# Altium schematic sheet Magnetics.SchDoc
size A3
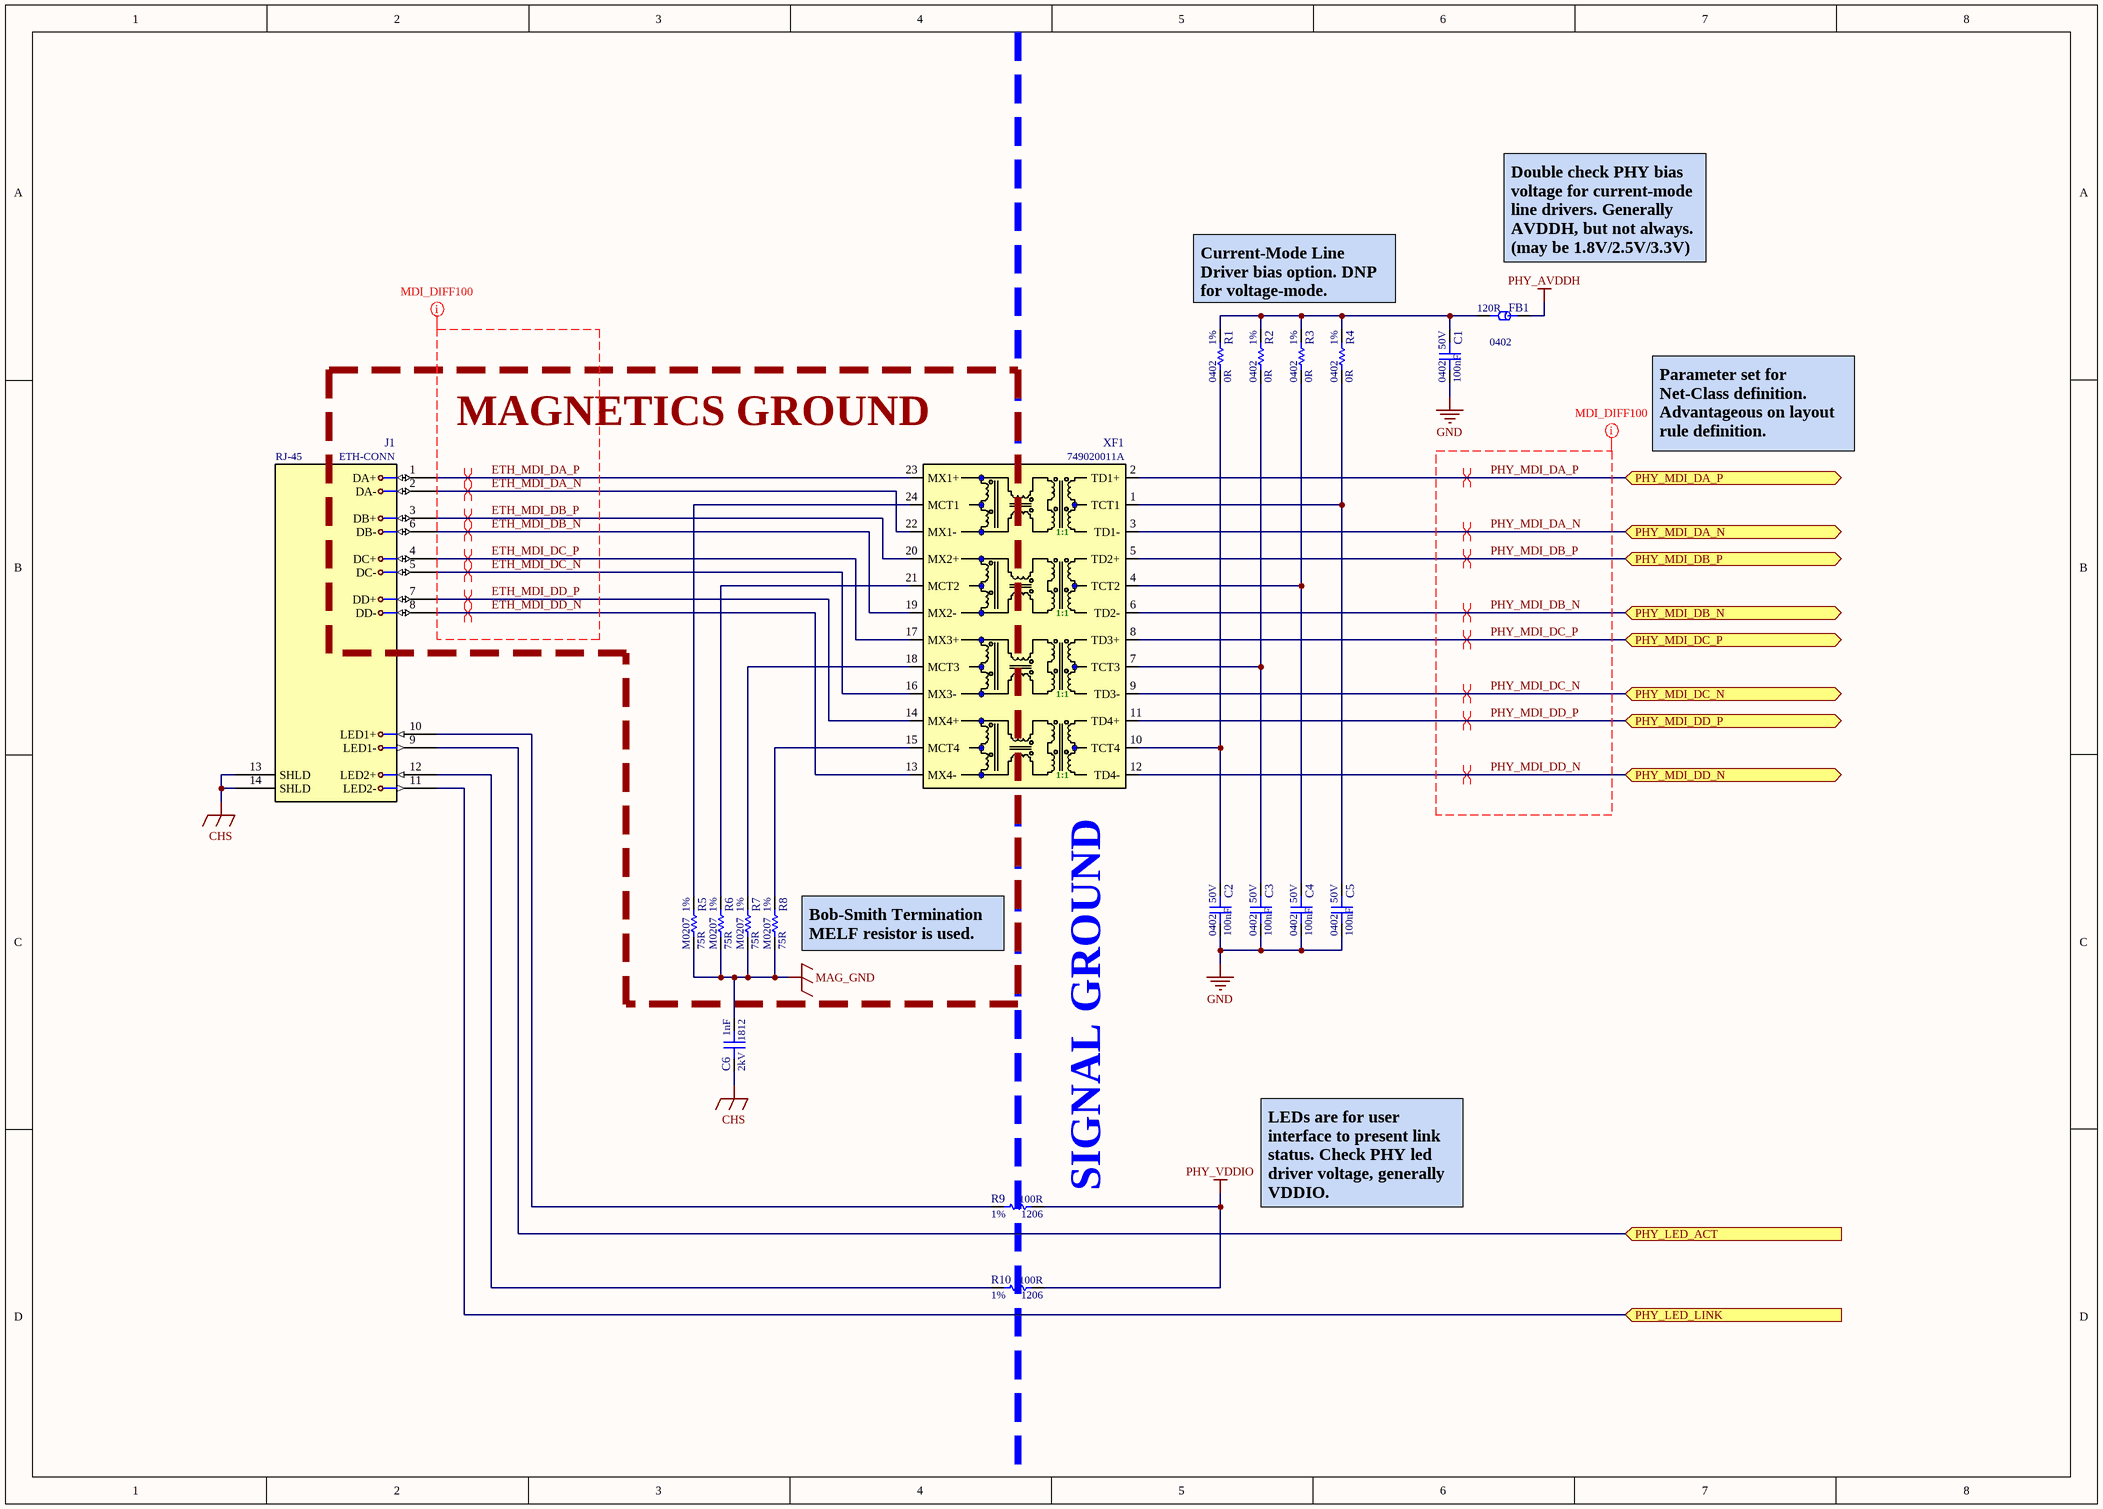
[diagram p0: Magnetics.SchDoc]

## Parts
C1  value 100nF  Voltage: 50V  Package: 0402  [C_0402_GEN_0.70H]  (hidden comment: Capacitor)
C2  value 100nF  Voltage: 50V  Package: 0402  [C_0402_GEN_0.70H]  (hidden comment: Capacitor)
C3  value 100nF  Voltage: 50V  Package: 0402  [C_0402_GEN_0.70H]  (hidden comment: Capacitor)
C4  value 100nF  Voltage: 50V  Package: 0402  [C_0402_GEN_0.70H]  (hidden comment: Capacitor)
C5  value 100nF  Voltage: 50V  Package: 0402  [C_0402_GEN_0.70H]  (hidden comment: Capacitor)
C6  value 1nF  Voltage: 2kV  Package: 1812  [C_1812_MED-N_1.55H]  (hidden comment: Capacitor)
FB1  value 120R  Package: 0402  [FB_0402_GEN_0.55h]  (hidden comment: FerriteBead)
J1  value ETH-CONN  Package: RJ-45  (hidden comment: B2C_ETH_JACK_#2)
R1  value 0R  Tolerance: 1%  Package: 0402  [R_0402_GEN_0.40H]  (hidden comment: StandardResistor)
R2  value 0R  Tolerance: 1%  Package: 0402  [R_0402_GEN_0.40H]  (hidden comment: StandardResistor)
R3  value 0R  Tolerance: 1%  Package: 0402  [R_0402_GEN_0.40H]  (hidden comment: StandardResistor)
R4  value 0R  Tolerance: 1%  Package: 0402  [R_0402_GEN_0.40H]  (hidden comment: StandardResistor)
R5  value 75R  Tolerance: 1%  Package: M0207  [MELF_0207_GEN_2.4H]  (hidden comment: StandardResistor)
R6  value 75R  Tolerance: 1%  Package: M0207  [MELF_0207_GEN_2.4H]  (hidden comment: StandardResistor)
R7  value 75R  Tolerance: 1%  Package: M0207  [MELF_0207_GEN_2.4H]  (hidden comment: StandardResistor)
R8  value 75R  Tolerance: 1%  Package: M0207  [MELF_0207_GEN_2.4H]  (hidden comment: StandardResistor)
R9  value 100R  Tolerance: 1%  Package: 1206  [R_0402_GEN_0.40H]  (hidden comment: StandardResistor)
R10  value 100R  Tolerance: 1%  Package: 1206  [R_0402_GEN_0.40H]  (hidden comment: StandardResistor)
XF1  value 749020011A  (hidden comment: GigEthXformer)

## Blocks framed on the sheet
MAGNETICS GROUND: J1 R5-R8

## Ports
PHY_LED_ACT (in), PHY_LED_LINK (in), PHY_MDI_DA_N (bidir), PHY_MDI_DA_P (bidir), PHY_MDI_DB_N (bidir), PHY_MDI_DB_P (bidir), PHY_MDI_DC_N (bidir), PHY_MDI_DC_P (bidir), PHY_MDI_DD_N (bidir), PHY_MDI_DD_P (bidir)

## Nets
CHS: C6.1 J1.13(SHLD) J1.14(SHLD)
GND: C1.2 C2.2 C3.2 C4.2 C5.2
MAG_GND: C6.2 R5.2 R6.2 R7.2 R8.2
PHY_AVDDH: FB1.1
PHY_VDDIO: R9.2 R10.2
ETH_MDI_DA_N: J1.2(DA-) XF1.22(MX1-)
ETH_MDI_DA_P: J1.1(DA+) XF1.23(MX1+)
ETH_MDI_DB_N: J1.6(DB-) XF1.19(MX2-)
ETH_MDI_DB_P: J1.3(DB+) XF1.20(MX2+)
ETH_MDI_DC_N: J1.5(DC-) XF1.16(MX3-)
ETH_MDI_DC_P: J1.4(DC+) XF1.17(MX3+)
ETH_MDI_DD_N: J1.8(DD-) XF1.13(MX4-)
ETH_MDI_DD_P: J1.7(DD+) XF1.14(MX4+)
PHY_LED_ACT: J1.9(LED1-) ; port PHY_LED_ACT
PHY_LED_LINK: J1.11(LED2-) ; port PHY_LED_LINK
PHY_MDI_DA_N: XF1.3(TD1-) ; port PHY_MDI_DA_N
PHY_MDI_DA_P: XF1.2(TD1+) ; port PHY_MDI_DA_P
PHY_MDI_DB_N: XF1.6(TD2-) ; port PHY_MDI_DB_N
PHY_MDI_DB_P: XF1.5(TD2+) ; port PHY_MDI_DB_P
PHY_MDI_DC_N: XF1.9(TD3-) ; port PHY_MDI_DC_N
PHY_MDI_DC_P: XF1.8(TD3+) ; port PHY_MDI_DC_P
PHY_MDI_DD_N: XF1.12(TD4-) ; port PHY_MDI_DD_N
PHY_MDI_DD_P: XF1.11(TD4+) ; port PHY_MDI_DD_P
NetC1_1: C1.1 FB1.2 R1.1 R2.1 R3.1 R4.1
NetC2_1: C2.1 R1.2 XF1.10(TCT4)
NetC3_1: C3.1 R2.2 XF1.7(TCT3)
NetC4_1: C4.1 R3.2 XF1.4(TCT2)
NetC5_1: C5.1 R4.2 XF1.1(TCT1)
NetJ1_10: J1.10(LED1+) R9.1
NetJ1_12: J1.12(LED2+) R10.1
NetR5_1: R5.1 XF1.24(MCT1)
NetR6_1: R6.1 XF1.21(MCT2)
NetR7_1: R7.1 XF1.18(MCT3)
NetR8_1: R8.1 XF1.15(MCT4)

## Layout directives
differential pair: ETH_MDI_DA_N, ETH_MDI_DA_P, ETH_MDI_DB_N, ETH_MDI_DB_P, ETH_MDI_DC_N, ETH_MDI_DC_P, ETH_MDI_DD_N, ETH_MDI_DD_P, PHY_MDI_DA_N, PHY_MDI_DA_P, PHY_MDI_DB_N, PHY_MDI_DB_P, PHY_MDI_DC_N, PHY_MDI_DC_P, PHY_MDI_DD_N, PHY_MDI_DD_P
net class MDI_DIF100: ETH_MDI_DA_N, ETH_MDI_DA_P, ETH_MDI_DB_N, ETH_MDI_DB_P, ETH_MDI_DC_N, ETH_MDI_DC_P, ETH_MDI_DD_N, ETH_MDI_DD_P, PHY_MDI_DA_N, PHY_MDI_DA_P, PHY_MDI_DB_N, PHY_MDI_DB_P, PHY_MDI_DC_N, PHY_MDI_DC_P, PHY_MDI_DD_N, PHY_MDI_DD_P

## Notes on the sheet
- Current-Mode Line Driver bias option. DNP for voltage-mode.
- Double check PHY bias voltage for current-mode line drivers. Generally AVDDH, but not always. (may be 1.8V/2.5V/3.3V)
- Parameter set for Net-Class definition. Advantageous on layout rule definition.
- (near R8) Bob-Smith Termination
  MELF resistor is used.
- SIGNAL GROUND
- LEDs are for user interface to present link status. Check PHY led driver voltage, generally VDDIO.
- (in symbol GigEthXformer) 1:1

## Library data of the parts
C1-C5 = CER_100nF_#5: CAP_CER_100nF_50V_X7R_10%_0402; Tolerance: 10%; Identifier: CER_100nF_#5
C6 = CER_1nF_#4: CAP_CER_1nF_2KV_X7R_10%_1812; Tolerance: 10%; Identifier: CER_1nF_#4
FB1 = FER_120R@100M: IND_FER_120R@100M_1.3A_25%_0402; Tolerance: ±25%; Voltage: X; Identifier: FER_120R@100M
R1-R4 R9 R10 = STD_100R_#1: RES_STD_100R_0.063W_1%_100ppm_0402; Voltage: 50V; Identifier: STD_100R_#1
R5-R8 = STD_75R_#1: RES_STD_75R_1W_1%_50ppm_MELF-0207; Voltage: 350V; Identifier: STD_75R_#1
XF1 = GigEthXformer: Gigabit Ethernet xformer; Package: SMD